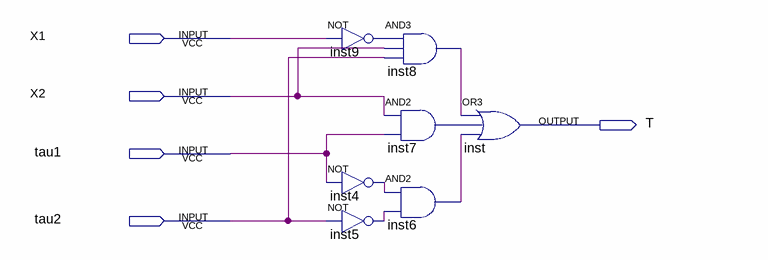
[diagram p0: schematic sheet]
// Quartus schematic Block3.bdf as structural Verilog: 7 symbols, 5 pins
module Block3 (
  input  X1,
  input  X2,
  input  tau1,
  input  tau2,
  output T
);

  wire inst4_out, inst5_out, inst6_out, inst7_out, inst8_out, inst9_out;

  not inst9 (inst9_out, X1);
  not inst4 (inst4_out, tau1);
  not inst5 (inst5_out, tau2);
  and inst8 (inst8_out, inst9_out, X2, tau2);
  and inst7 (inst7_out, X2, tau1);
  and inst6 (inst6_out, inst4_out, inst5_out);
  or inst (T, inst8_out, inst7_out, inst6_out);
endmodule
